# Altium project JadePlus_v0.3.1.PrjPcb
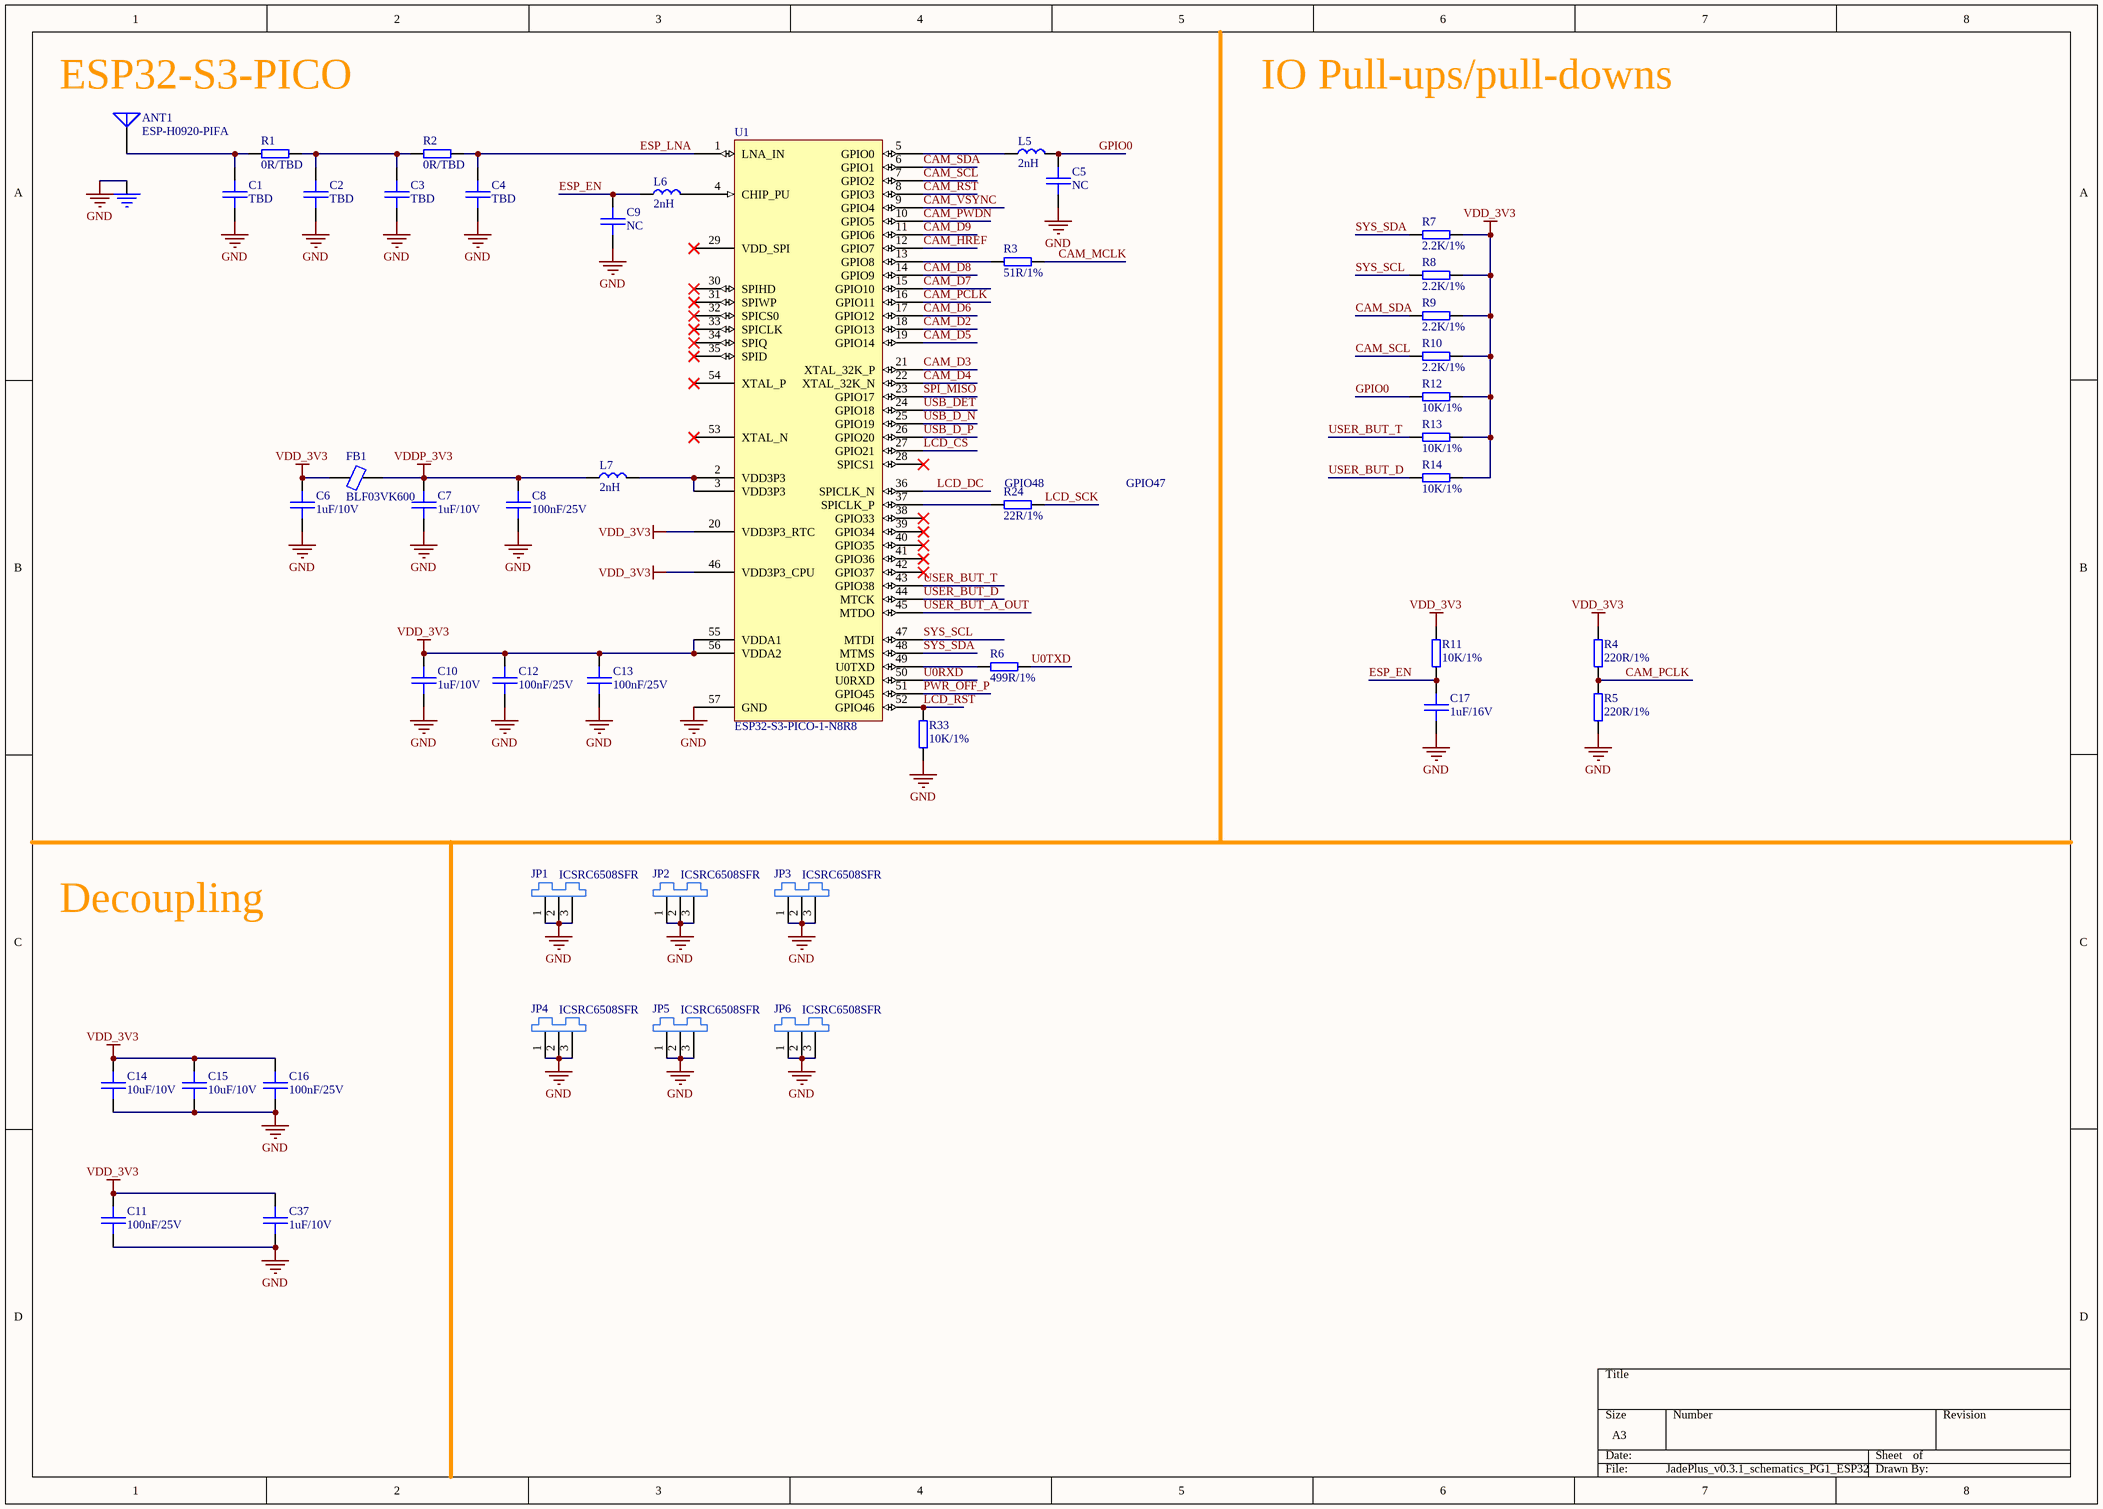
[diagram p0: JadePlus_v0.3.1_schematics_PG1_ESP32S3.SchDoc]
3 sheets, 120 parts. Net scope: global (net labels, ports and power ports of the same name join across sheets).
Board file: JadePlus_v0.3.1_board.PcbDoc
Sheets:
  JadePlus_v0.3.1_schematics_PG1_ESP32S3.SchDoc
  JadePlus_v0.3.1_schematics_PG2_PMS.SchDoc
  JadePlus_v0.3.1_schematics_PG3_CONN.SchDoc

## Sheet JadePlus_v0.3.1_schematics_PG1_ESP32S3.SchDoc
size A3; SheetNumber: 1; SheetTotal: 3

### Parts
ANT1  ESP-H0920-PIFA  [ESP-H0920-PIFA]
C1  TBD  [C0201-HD]
C2  TBD  [C0201-HD]
C3  TBD  [C0201-HD]
C4  TBD  [C0201-HD]
C5  NC  [C0201-HD]
C6  1uF/10V  [C0201-HD]
C7  1uF/10V  [C0201-HD]
C8  100nF/25V  [C0201-HD]
C9  NC  [C0201-HD]
C10  1uF/10V  [C0201-HD]
C11  100nF/25V  [C0201-HD]
C12  100nF/25V  [C0201-HD]
C13  100nF/25V  [C0201-HD]
C14  10uF/10V  [C0402-L-HD]
C15  10uF/10V  [C0402-L-HD]
C16  100nF/25V  [C0201-HD]
C17  1uF/16V  [C0402-HD]
C37  1uF/10V  [C0201-HD]
FB1  BLF03VK600  [L0201-HD]
JP1  ICSRC6508SFR  [SMD_3P-L6.7-W0.9-R3-P2.65-ICSRC6508SFR]
JP2  ICSRC6508SFR  [SMD_3P-L6.7-W0.9-R3-P2.65-ICSRC6508SFR]
JP3  ICSRC6508SFR  [SMD_3P-L6.7-W0.9-R3-P2.65-ICSRC6508SFR]
JP4  ICSRC6508SFR  [SMD_3P-L6.7-W0.9-R3-P2.65-ICSRC6508SFR]
JP5  ICSRC6508SFR  [SMD_3P-L6.7-W0.9-R3-P2.65-ICSRC6508SFR]
JP6  ICSRC6508SFR  [SMD_3P-L6.7-W0.9-R3-P2.65-ICSRC6508SFR]
L5  2nH  [L0201-HD]
L6  2nH  [L0201-HD]
L7  2nH  [L0201-HD]
R1  0R/TBD  [C0201-HD]
R2  0R/TBD  [C0201-HD]
R3  51R/1%  [R0402-HD]
R4  220R/1%  [R0402-HD]
R5  220R/1%  [R0402-HD]
R6  499R/1%  [R0402-HD]
R7  2.2K/1%  [R0402-HD]
R8  2.2K/1%  [R0402-HD]
R9  2.2K/1%  [R0402-HD]
R10  2.2K/1%  [R0402-HD]
R11  10K/1%  [R0402-HD]
R12  10K/1%  [R0402-HD]
R13  10K/1%  [R0402-HD]
R14  10K/1%  [R0402-HD]
R24  22R/1%  [R0402-HD]
R33  10K/1%  [R0402-HD]
U1  ESP32-S3-PICO-1-N8R8  [QFN40P700X700X90_HS-57N]

### Nets
GND: ANT1.2(G) C1.1 C2.1 C3.1 C4.1 C5.2 C6.2 C7.1 C8.2 C9.2 C10.2 C11.2 C12.2 C13.2 C14.1 C15.1 C16.2 C17.1 C37.2 JP1.1(GND) JP1.2(GND) JP1.3(GND) JP2.1(GND) JP2.2(GND) JP2.3(GND) JP3.1(GND) JP3.2(GND) JP3.3(GND) JP4.1(GND) JP4.2(GND) JP4.3(GND) JP5.1(GND) JP5.2(GND) JP5.3(GND) JP6.1(GND) JP6.2(GND) JP6.3(GND) R5.2 R33.1 U1.57(GND)
VDD_3V3: C6.1 C10.1 C11.1 C12.1 C13.1 C14.2 C15.2 C16.1 C37.1 FB1.2 R4.1 R7.2 R8.2 R9.2 R10.2 R11.1 R12.2 R13.2 R14.2 U1.20(VDD3P3_RTC) U1.46(VDD3P3_CPU) U1.55(VDDA1) U1.56(VDDA2)
VDDP_3V3: C7.2 C8.1 FB1.1 L7.2
CAM_D2: U1.18(GPIO13)
CAM_D3: U1.21(XTAL_32K_P)
CAM_D4: U1.22(XTAL_32K_N)
CAM_D5: U1.19(GPIO14)
CAM_D6: U1.17(GPIO12)
CAM_D7: U1.15(GPIO10)
CAM_D8: U1.14(GPIO9)
CAM_D9: U1.11(GPIO6)
CAM_HREF: U1.12(GPIO7)
CAM_MCLK: R3.1
CAM_PCLK: R4.2 R5.1 U1.16(GPIO11)
CAM_PWDN: U1.10(GPIO5)
CAM_RST: U1.8(GPIO3)
CAM_SCL: R10.1 U1.7(GPIO2)
CAM_SDA: R9.1 U1.6(GPIO1)
CAM_VSYNC: U1.9(GPIO4)
ESP_EN: C9.1 C17.2 L6.2 R11.2
ESP_LNA: C4.2 R2.2 U1.1(LNA_IN)
GPIO0: C5.1 L5.1 R12.1
LCD_CS: U1.27(GPIO21)
LCD_DC: U1.36(SPICLK_N)
LCD_RST: R33.2 U1.52(GPIO46)
LCD_SCK: R24.1
PWR_OFF_P: U1.51(GPIO45)
SPI_MISO: U1.23(GPIO17)
SYS_SCL: R8.1 U1.47(MTDI)
SYS_SDA: R7.1 U1.48(MTMS)
U0RXD: U1.50(U0RXD)
U0TXD: R6.1
USB_D_N: U1.25(GPIO19)
USB_D_P: U1.26(GPIO20)
USB_DET: U1.24(GPIO18)
USER_BUT_A_OUT: U1.45(MTDO)
USER_BUT_D: R14.1 U1.44(MTCK)
USER_BUT_T: R13.1 U1.43(GPIO38)
NetANT1_1: ANT1.1(A) C1.2 R1.1
NetC2_2: C2.2 C3.2 R1.2 R2.1
NetL5_2: L5.2 U1.5(GPIO0)
NetL6_1: L6.1 U1.4(CHIP_PU)
NetL7_1: L7.1 U1.2(VDD3P3) U1.3(VDD3P3)
NetR3_2: R3.2 U1.13(GPIO8)
NetR6_2: R6.2 U1.49(U0TXD)
NetR24_2: R24.2 U1.37(SPICLK_P)

Not connected (* = marked no-connect by the designer): U1 28(SPICS1)* 29(VDD_SPI)* 30(SPIHD)* 31(SPIWP)* 32(SPICS0)* 33(SPICLK)* 34(SPIQ)* 35(SPID)* 38(GPIO33)* 39(GPIO34)* 40(GPIO35)* 41(GPIO36)* 42(GPIO37)* 53(XTAL_N)* 54(XTAL_P)*

### Notes on the sheet
- (near ANT1) ESP32-S3-PICO
- IO Pull-ups/pull-downs
- (near R24) GPIO48
- GPIO47
- Decoupling

### Library data of the parts
ANT1 = Antenna_MIFA: Meandered Inverted F Antenna
C1-C17 C37 = SMT_C_0402: Surface mount capacitor 0402
FB1 = SMT_FB_0402: C1857815
L5-L7 = SMT_L_0201: Surface mount inductor 0201
R1-R14 R24 R33 = SMT_R_0402: Surface mount resistor 0402
U1 = ESP32-S3

## Sheet JadePlus_v0.3.1_schematics_PG2_PMS.SchDoc
size A3; SheetNumber: 2; SheetTotal: 3
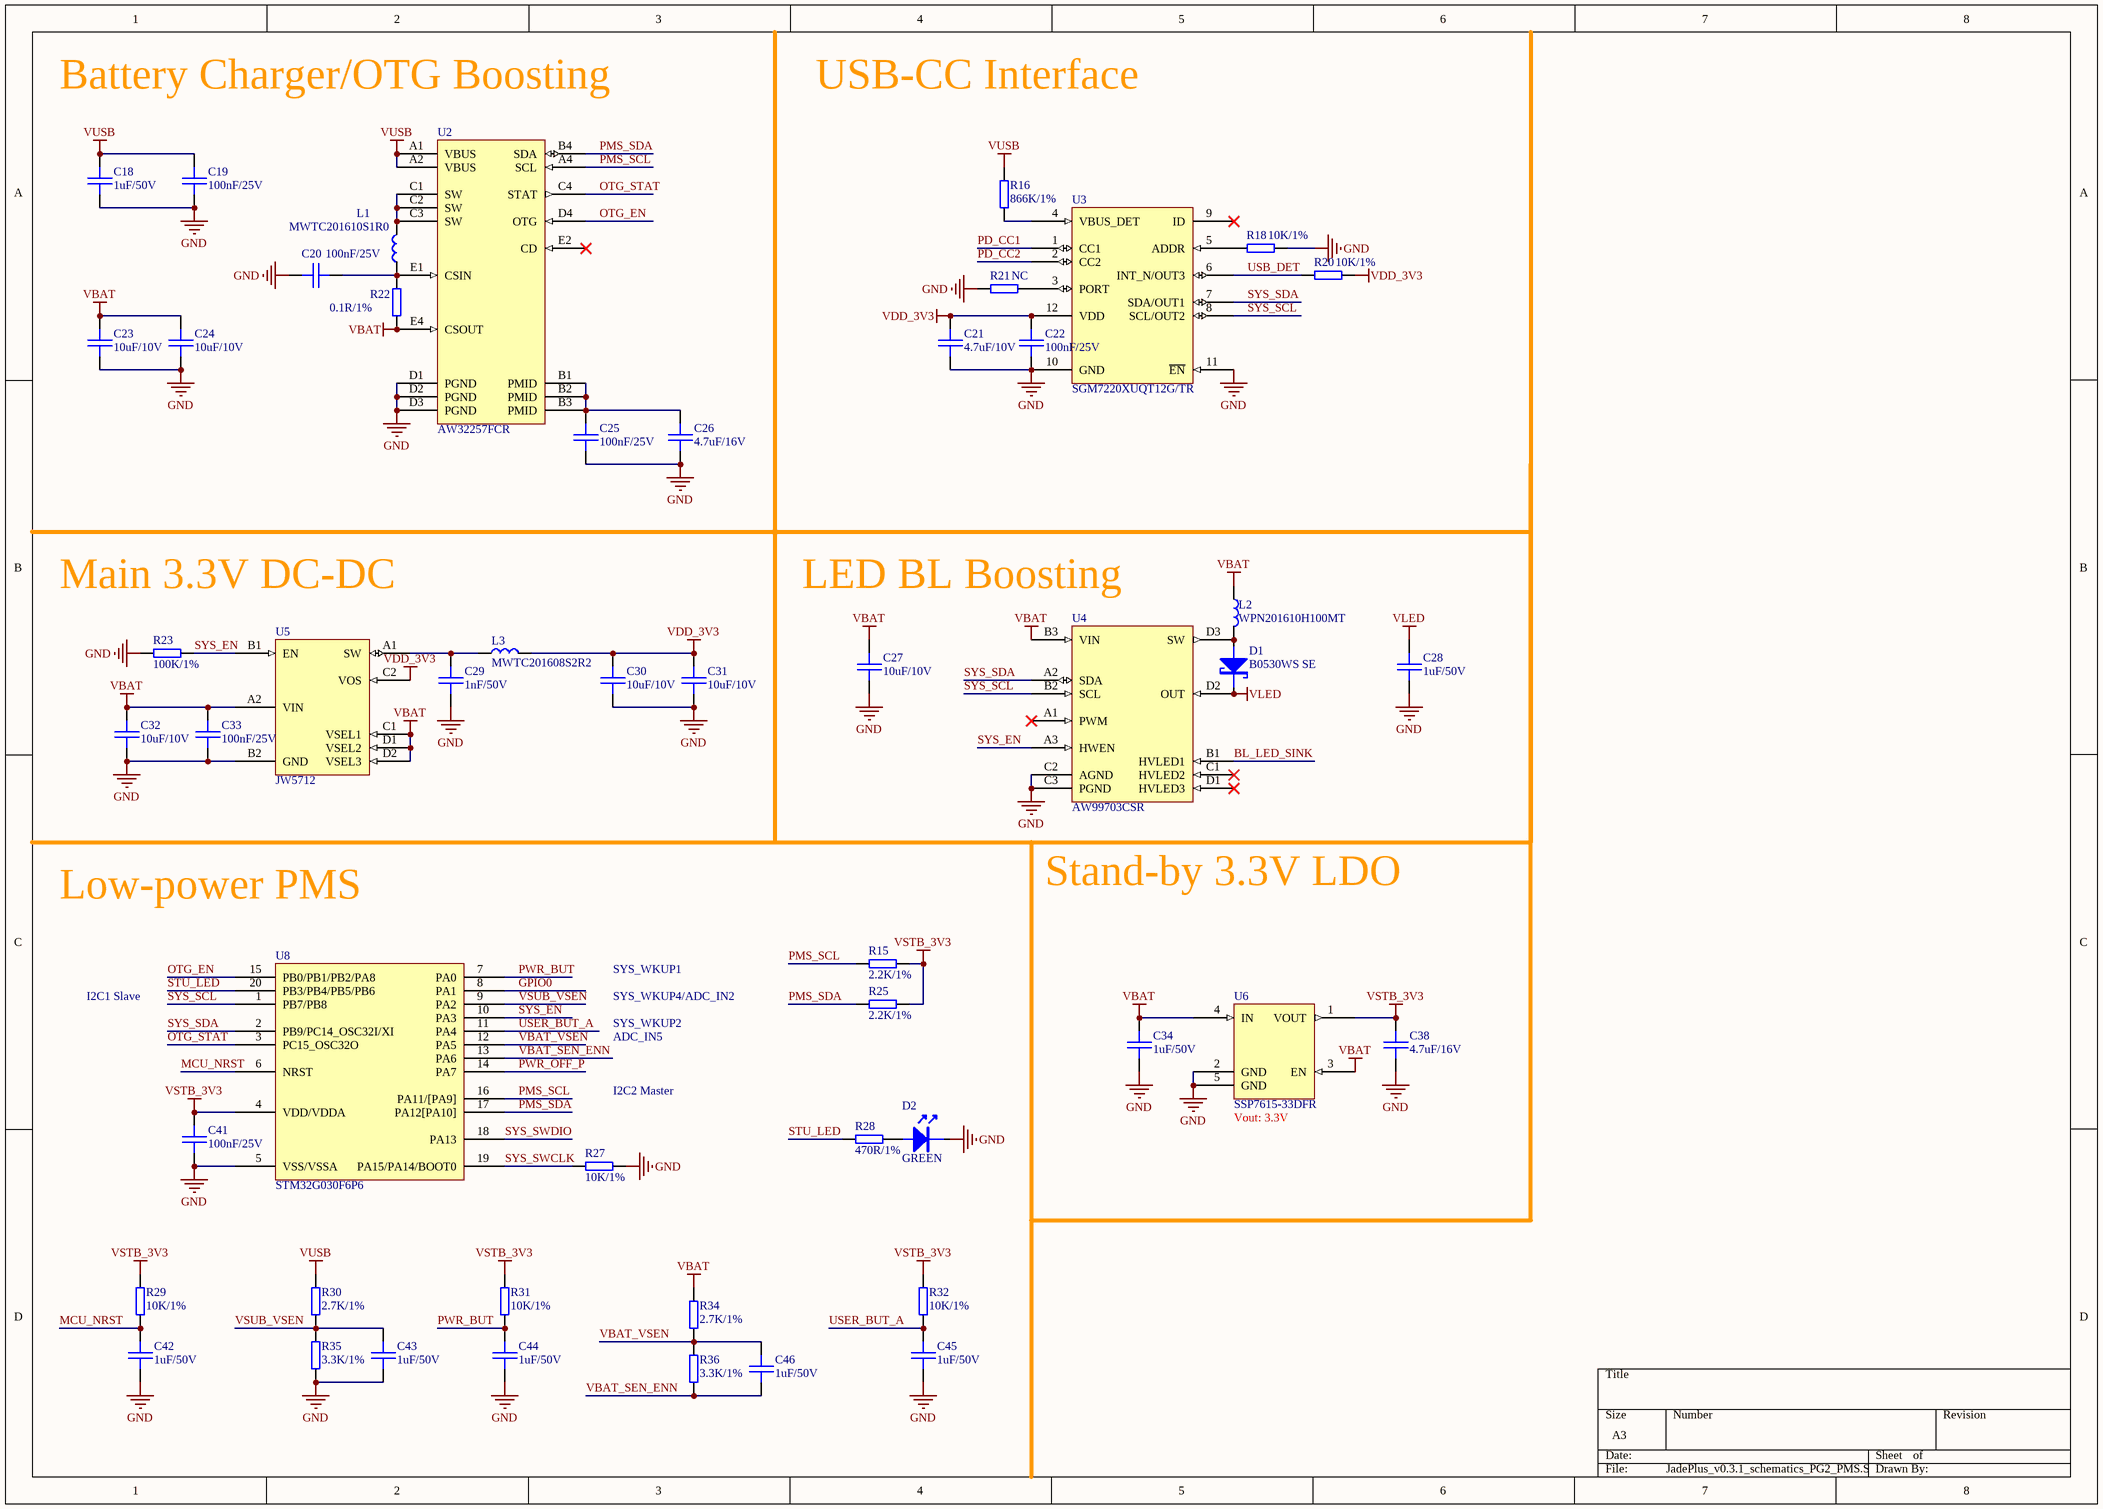
[diagram p1: JadePlus_v0.3.1_schematics_PG2_PMS.SchDoc]

### Parts
C18  1uF/50V  [C0402-L-HD]
C19  100nF/25V  [C0201-HD]
C20  100nF/25V  [C0402-HD]
C21  4.7uF/10V  [C0402-L-HD]
C22  100nF/25V  [C0201-HD]
C23  10uF/10V  [C0402-L-HD]
C24  10uF/10V  [C0402-L-HD]
C25  100nF/25V  [C0201-HD]
C26  4.7uF/16V  [C0402-L-HD]
C27  10uF/10V  [C0402-L-HD]
C28  1uF/50V  [C0402-L-HD]
C29  1nF/50V  [C0201-HD]
C30  10uF/10V  [C0402-L-HD]
C31  10uF/10V  [C0402-L-HD]
C32  10uF/10V  [C0402-L-HD]
C33  100nF/25V  [C0201-HD]
C34  1uF/50V  [C0402-L-HD]
C38  4.7uF/16V  [C0402-L-HD]
C41  100nF/25V  [C0201-HD]
C42  1uF/50V  [C0402-L-HD]
C43  1uF/50V  [C0402-L-HD]
C44  1uF/50V  [C0402-L-HD]
C45  1uF/50V  [C0402-L-HD]
C46  1uF/50V  [C0402-L-HD]
D1  B0530WS SE  [SMT_DIODE_SOD_323]
D2  GREEN  [SMT_LED_0603]
L1  MWTC201610S1R0  [MWTC201610-HD]
L2  WPN201610H100MT  [MWTC201610-HD]
L3  MWTC201608S2R2  [MWTC201610-HD]
R15  2.2K/1%  [R0402-HD]
R16  866K/1%  [R0402-HD]
R18  10K/1%  [R0402-HD]
R20  10K/1%  [R0402-HD]
R21  NC  [R0402-HD]
R22  0.1R/1%  [R0603-HD]
R23  100K/1%  [R0402-HD]
R25  2.2K/1%  [R0402-HD]
R27  10K/1%  [R0402-HD]
R28  470R/1%  [R0402-HD]
R29  10K/1%  [R0402-HD]
R30  2.7K/1%  [R0402-HD]
R31  10K/1%  [R0402-HD]
R32  10K/1%  [R0402-HD]
R34  2.7K/1%  [R0402-HD]
R35  3.3K/1%  [R0402-HD]
R36  3.3K/1%  [R0402-HD]
U2  AW32257FCR  [BGA20C40P4X5_200X200X60]
U3  SGM7220XUQT12G/TR  [QFN40P160X160X60-12L]
U4  AW99703CSR  [BGA12C40P3X4_124X164X64]
U5  JW5712  [BGA8C40P2X4_86X156X60]
U6  SSP7615-33DFR  [X2SON4]
U8  STM32G030F6P6  [TSOP-20-HD]

### Nets
GND: C18.1 C19.1 C20.2 C21.1 C22.1 C23.1 C24.1 C25.1 C26.1 C27.1 C28.1 C29.1 C30.1 C31.1 C32.1 C33.1 C34.1 C38.1 C41.1 C42.1 C43.1 C44.1 C45.1 D2.2(K) R18.2 R21.1 R23.1 R27.1 R35.2 U2.D1(PGND) U2.D2(PGND) U2.D3(PGND) U3.10(GND) U3.11(~{EN}) U4.C2(AGND) U4.C3(PGND) U5.B2(GND) U6.2(GND) U6.5(GND) U8.5(VSS/VSSA)
VBAT: C23.2 C24.2 C27.2 C32.2 C33.2 C34.2 L2.1 R22.1 R34.1 U2.E4(CSOUT) U4.B3(VIN) U5.A2(VIN) U5.C1(VSEL1) U5.D1(VSEL2) U5.D2(VSEL3) U6.3(EN) U6.4(IN)
VDD_3V3: C21.2 C22.2 C30.2 C31.2 L3.1 R20.2 U3.12(VDD) U5.C2(VOS)
VLED: C28.2 D1.2(K) U4.D2(OUT)
VSTB_3V3: C38.2 C41.2 R15.2 R25.2 R29.1 R31.1 R32.1 U6.1(VOUT) U8.4(VDD/VDDA)
VUSB: C18.2 C19.2 R16.1 R30.1 U2.A1(VBUS) U2.A2(VBUS)
BL_LED_SINK: U4.B1(HVLED1)
GPIO0: U8.8(PA1)
MCU_NRST: C42.2 R29.2 U8.6(NRST)
OTG_EN: U2.D4(OTG) U8.15(PB0/PB1/PB2/PA8)
OTG_STAT: U2.C4(STAT) U8.3(PC15_OSC32O)
PD_CC1: U3.1(CC1)
PD_CC2: U3.2(CC2)
PMS_SCL: R15.1 U2.A4(SCL) U8.16(PA11/[PA9])
PMS_SDA: R25.1 U2.B4(SDA) U8.17(PA12[PA10])
PWR_BUT: C44.2 R31.2 U8.7(PA0)
PWR_OFF_P: U8.14(PA7)
STU_LED: R28.2 U8.20(PB3/PB4/PB5/PB6)
SYS_EN: R23.2 U4.A3(HWEN) U5.B1(EN) U8.10(PA3)
SYS_SCL: U3.8(SCL/OUT2) U4.B2(SCL) U8.1(PB7/PB8)
SYS_SDA: U3.7(SDA/OUT1) U4.A2(SDA) U8.2(PB9/PC14_OSC32I/XI)
SYS_SWCLK: R27.2 U8.19(PA15/PA14/BOOT0)
SYS_SWDIO: U8.18(PA13)
USB_DET: R20.1 U3.6(INT_N/OUT3)
USER_BUT_A: C45.2 R32.2 U8.11(PA4)
VBAT_SEN_ENN: C46.1 R36.2 U8.13(PA6)
VBAT_VSEN: C46.2 R34.2 R36.1 U8.12(PA5)
VSUB_VSEN: C43.2 R30.2 R35.1 U8.9(PA2)
NetC20_1: C20.1 L1.2 R22.2 U2.E1(CSIN)
NetC25_2: C25.2 C26.2 U2.B1(PMID) U2.B2(PMID) U2.B3(PMID)
NetC29_2: C29.2 L3.2 U5.A1(SW)
NetD1_1: D1.1(A) L2.2 U4.D3(SW)
NetD2_1: D2.1(A) R28.1
NetL1_1: L1.1 U2.C1(SW) U2.C2(SW) U2.C3(SW)
NetR16_2: R16.2 U3.4(VBUS_DET)
NetR18_1: R18.1 U3.5(ADDR)
NetR21_2: R21.2 U3.3(PORT)

Not connected (* = marked no-connect by the designer): U2 E2(CD)*; U3 9(ID)*; U4 A1(PWM)* C1(HVLED2)* D1(HVLED3)*

### Notes on the sheet
- Battery Charger/OTG Boosting
- USB-CC Interface
- Main 3.3V DC-DC
- LED BL Boosting
- Low-power PMS
- Stand-by 3.3V LDO
- SYS_WKUP1
- I2C1 Slave
- SYS_WKUP4/ADC_IN2
- SYS_WKUP2
- ADC_IN5
- I2C2 Master
- (near U6) Vout: 3.3V

### Library data of the parts
C18-C34 C38 C41-C46 = SMT_C_0402: Surface mount capacitor 0402
D1 = SMT_DIODE_SCHOTTKY_SOD_323: Surface mount schottky diode SOD-323(0805) Package / C22626
D2 = SMT_LED_0603: Surface mount LED 0603
L1-L3 = SMT_L_0805: Surface mount inductor 0805
R15 R16 R18 R20 R21 R23 R25 R27-R32 R34-R36 = SMT_R_0402: Surface mount resistor 0402
R22 = SMT_R_0603: Surface mount resistor 0603
U2 = AW32257
U3 = SGM7220: SGM7220XUQT12G/TR / TUSB320 / HUSB320_BA000-QN12R
U4 = AW99703
U6 = AP7343: 300mA HIGH PSRR LOW NOISE LDO WITH ENABLE

## Sheet JadePlus_v0.3.1_schematics_PG3_CONN.SchDoc
size A3; SheetNumber: 3; SheetTotal: 3
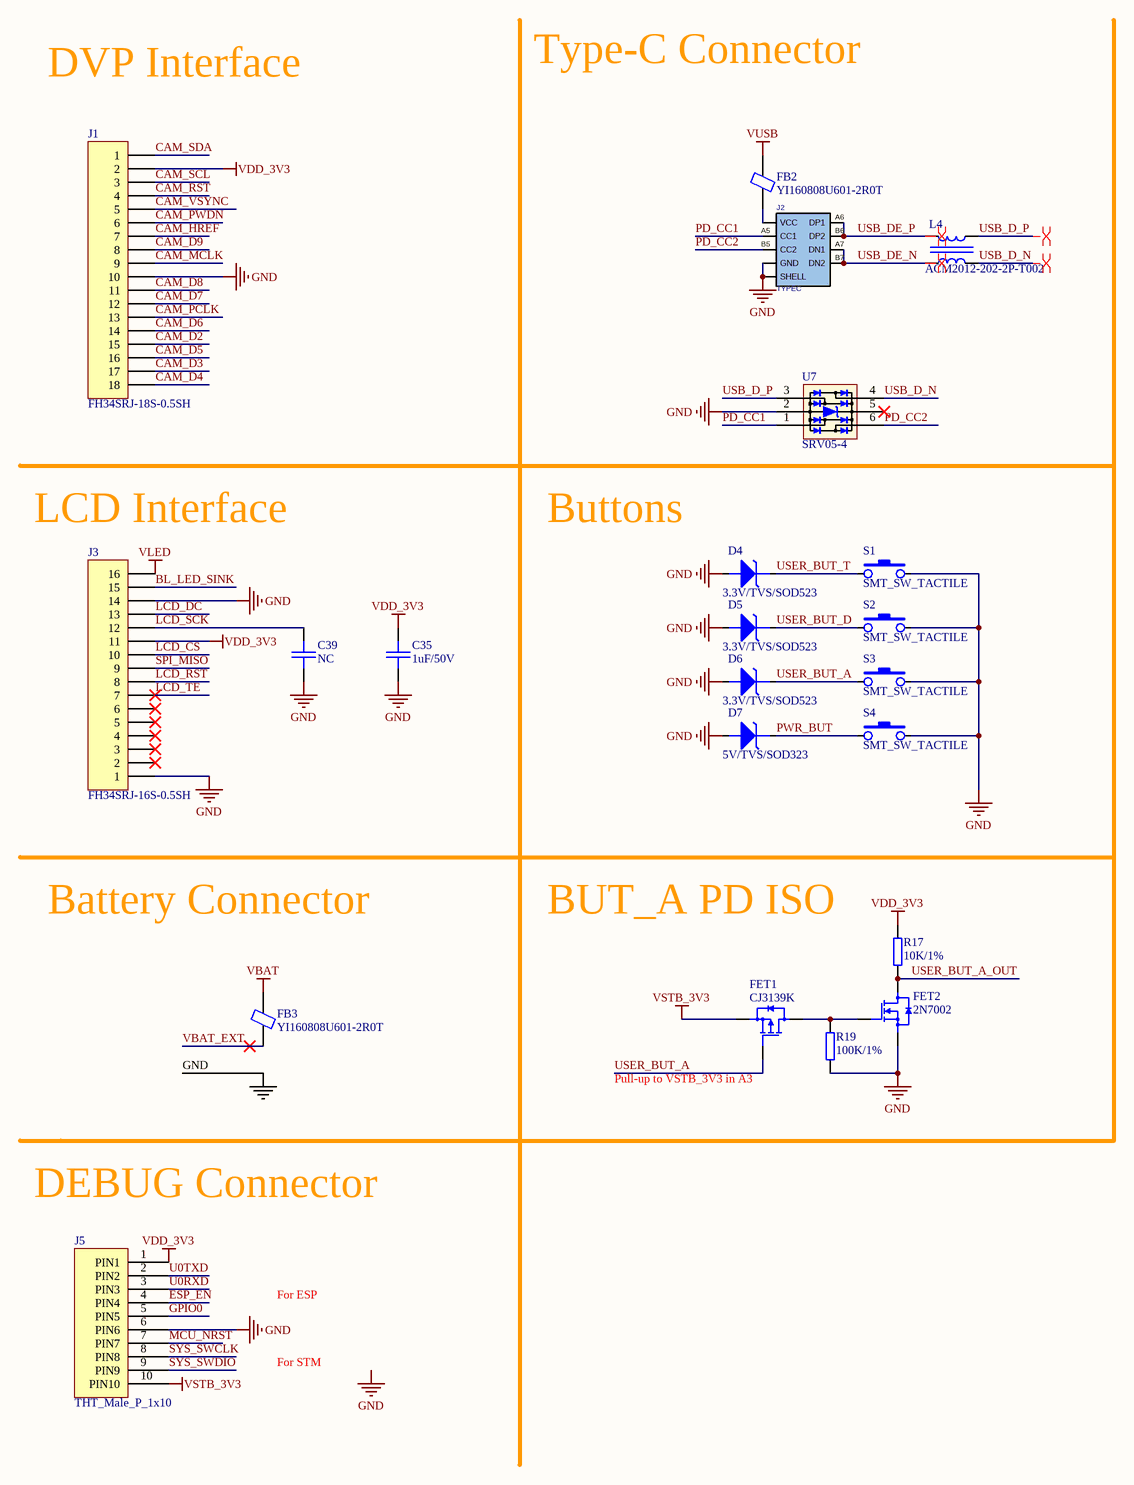
[diagram p2: JadePlus_v0.3.1_schematics_PG3_CONN.SchDoc]

### Parts
C35  1uF/50V  [C0402-L-HD]
C39  NC  [C0201-HD]
D4  3.3V/TVS/SOD523  [SMT_DIODE_SOD_523]
D5  3.3V/TVS/SOD523  [SMT_DIODE_SOD_523]
D6  3.3V/TVS/SOD523  [SMT_DIODE_SOD_523]
D7  5V/TVS/SOD323  [SMT_DIODE_SOD_323]
FB2  YI160808U601-2R0T  [L0603-HD]
FB3  YI160808U601-2R0T  [L0603-HD]
FET1  CJ3139K  [SOT-723-HD]
FET2  2N7002  [SOT-723-HD]
J1  FH34SRJ-18S-0.5SH  [FH34SRJ-18S-0.5SH]
J2  TYPEC  [USB_TYPEC_16P_HD]
J3  FH34SRJ-16S-0.5SH  [FPC_0.5MM_16P_H1.0_DNUP_FH34SRJ-16S-0.5SH]
J5  THT_Male_P_1x10  [THT_Male_P_1x10-2.54mm]
L4  ACM2012-202-2P-T002  [ACM2012]
R17  10K/1%  [R0402-HD]
R19  100K/1%  [R0402-HD]
S1  SMT_SW_TACTILE  [SMT_SW_TS_1186D_C_A]
S2  SMT_SW_TACTILE  [SMT_SW_TS_1186D_C_A]
S3  SMT_SW_TACTILE  [SMT_SW_PTS_820]
S4  SMT_SW_TACTILE  [SMT_SW_TS_1186D_C_A]
U7  SRV05-4  [SOT-236-HD]

### Nets
GND: C35.1 C39.2 D4.1(A) D5.1(A) D6.1(A) D7.1(A) FET2.2(S) J1.10 J2.GND J2.SHELL J3.1 J3.14 J5.6(PIN6) R19.2 S1.2 S2.2 S3.2 S4.2 U7.2
VBAT: FB3.1
VDD_3V3: C35.2 J1.2 J3.11 J5.1(PIN1) R17.1
VLED: J3.16
VSTB_3V3: FET1.2(S) J5.10(PIN10)
VUSB: FB2.1
BL_LED_SINK: J3.15
CAM_D2: J1.15
CAM_D3: J1.17
CAM_D4: J1.18
CAM_D5: J1.16
CAM_D6: J1.14
CAM_D7: J1.12
CAM_D8: J1.11
CAM_D9: J1.8
CAM_HREF: J1.7
CAM_MCLK: J1.9
CAM_PCLK: J1.13
CAM_PWDN: J1.6
CAM_RST: J1.4
CAM_SCL: J1.3
CAM_SDA: J1.1
CAM_VSYNC: J1.5
ESP_EN: J5.4(PIN4)
GPIO0: J5.5(PIN5)
LCD_CS: J3.10
LCD_DC: J3.13
LCD_RST: J3.8
LCD_SCK: C39.1 J3.12
LCD_TE: J3.7
MCU_NRST: J5.7(PIN7)
PD_CC1: J2.A5(CC1) U7.1
PD_CC2: J2.B5(CC2) U7.6
PWR_BUT: D7.2(K) S4.1
SPI_MISO: J3.9
SYS_SWCLK: J5.8(PIN8)
SYS_SWDIO: J5.9(PIN9)
U0RXD: J5.3(PIN3)
U0TXD: J5.2(PIN2)
USB_D_N: L4.3 U7.4
USB_D_P: L4.4 U7.3
USB_DE_N: J2.A7(DN1) J2.B7(DN2) L4.2
USB_DE_P: J2.A6(DP1) J2.B6(DP2) L4.1
USER_BUT_A: D6.2(K) FET1.1(G) S3.1
USER_BUT_A_OUT: FET2.3(D) R17.2
USER_BUT_D: D5.2(K) S2.1
USER_BUT_T: D4.2(K) S1.1
VBAT_EXT: FB3.2
NetFB2_2: FB2.2 J2.VBUS(VCC)
NetFET1_3: FET1.3(D) FET2.1(G) R19.1

Not connected (* = marked no-connect by the designer): J3 2* 3* 4* 5* 6*; U7 5*

### Layout directives
differential pair: USB_D_N, USB_D_P, USB_DE_N, USB_DE_P

### Notes on the sheet
- DVP Interface
- Type-C Connector
- (near J3) LCD Interface
- Buttons
- Battery Connector
- BUT_A PD ISO
- GND
- (near FET1) Pull-up to VSTB_3V3 in A3
- DEBUG Connector
- For ESP
- For STM
- Labels drawn without touching a wire or pin: GND

### Library data of the parts
C35 C39 = SMT_C_0402: Surface mount capacitor 0402
D4-D7 = SMT_DIODE_TVS_U_SOD_523: Surface mount unidirectional TVS diode SOD-523(0603) Package
FB2 FB3 = SMT_FB_0603: Surface mount ferrite beads 0603
FET1 = SI2301-P-Ch-MOSFET: SI2301-P-Ch,-2.3A, -20V.RDS(ON) = 0.190Ω @ VGS = -2.5 V
FET2 = SI2302-N-Ch-MOSFET: SI2302-N-Ch,3A, 20V.RDS(ON) = 0.082Ω @ VGS = 2.5 V
J1 = Header 18: Header, 18-Pin; LatestRevisionDate: 17-Jul-2002; LatestRevisionNote: Re-released for DXP Platform.; Publisher: Altium Limited
J2 = USB_TYPEC_16P
J3 = Header 16: Header, 16-Pin; LatestRevisionDate: 17-Jul-2002; LatestRevisionNote: Re-released for DXP Platform.; Publisher: Altium Limited
J5 = THT_Male_P_1x10: THT Male pin header strip 1x10
L4 = ACM2012
R17 R19 = SMT_R_0402: Surface mount resistor 0402
S1-S4 = SMT_SW_TACTILE: Generic SMT Tactile Switch
U7 = SRV05-4: Low Capacitance(3pF) TVS Diode Array

## Nets that join several sheets
GND: JadePlus_v0.3.1_schematics_PG1_ESP32S3 (40 pins), JadePlus_v0.3.1_schematics_PG2_PMS (40 pins), JadePlus_v0.3.1_schematics_PG3_CONN (19 pins)
VBAT: JadePlus_v0.3.1_schematics_PG2_PMS (17 pins), JadePlus_v0.3.1_schematics_PG3_CONN (FB3.1)
VDD_3V3: JadePlus_v0.3.1_schematics_PG1_ESP32S3 (23 pins), JadePlus_v0.3.1_schematics_PG2_PMS (8 pins), JadePlus_v0.3.1_schematics_PG3_CONN (5 pins)
VLED: JadePlus_v0.3.1_schematics_PG2_PMS (C28.2 D1.2 U4.D2), JadePlus_v0.3.1_schematics_PG3_CONN (J3.16)
VSTB_3V3: JadePlus_v0.3.1_schematics_PG2_PMS (9 pins), JadePlus_v0.3.1_schematics_PG3_CONN (FET1.2 J5.10)
VUSB: JadePlus_v0.3.1_schematics_PG2_PMS (6 pins), JadePlus_v0.3.1_schematics_PG3_CONN (FB2.1)
BL_LED_SINK: JadePlus_v0.3.1_schematics_PG2_PMS (U4.B1), JadePlus_v0.3.1_schematics_PG3_CONN (J3.15)
CAM_D2: JadePlus_v0.3.1_schematics_PG1_ESP32S3 (U1.18), JadePlus_v0.3.1_schematics_PG3_CONN (J1.15)
CAM_D3: JadePlus_v0.3.1_schematics_PG1_ESP32S3 (U1.21), JadePlus_v0.3.1_schematics_PG3_CONN (J1.17)
CAM_D4: JadePlus_v0.3.1_schematics_PG1_ESP32S3 (U1.22), JadePlus_v0.3.1_schematics_PG3_CONN (J1.18)
CAM_D5: JadePlus_v0.3.1_schematics_PG1_ESP32S3 (U1.19), JadePlus_v0.3.1_schematics_PG3_CONN (J1.16)
CAM_D6: JadePlus_v0.3.1_schematics_PG1_ESP32S3 (U1.17), JadePlus_v0.3.1_schematics_PG3_CONN (J1.14)
CAM_D7: JadePlus_v0.3.1_schematics_PG1_ESP32S3 (U1.15), JadePlus_v0.3.1_schematics_PG3_CONN (J1.12)
CAM_D8: JadePlus_v0.3.1_schematics_PG1_ESP32S3 (U1.14), JadePlus_v0.3.1_schematics_PG3_CONN (J1.11)
CAM_D9: JadePlus_v0.3.1_schematics_PG1_ESP32S3 (U1.11), JadePlus_v0.3.1_schematics_PG3_CONN (J1.8)
CAM_HREF: JadePlus_v0.3.1_schematics_PG1_ESP32S3 (U1.12), JadePlus_v0.3.1_schematics_PG3_CONN (J1.7)
CAM_MCLK: JadePlus_v0.3.1_schematics_PG1_ESP32S3 (R3.1), JadePlus_v0.3.1_schematics_PG3_CONN (J1.9)
CAM_PCLK: JadePlus_v0.3.1_schematics_PG1_ESP32S3 (R4.2 R5.1 U1.16), JadePlus_v0.3.1_schematics_PG3_CONN (J1.13)
CAM_PWDN: JadePlus_v0.3.1_schematics_PG1_ESP32S3 (U1.10), JadePlus_v0.3.1_schematics_PG3_CONN (J1.6)
CAM_RST: JadePlus_v0.3.1_schematics_PG1_ESP32S3 (U1.8), JadePlus_v0.3.1_schematics_PG3_CONN (J1.4)
CAM_SCL: JadePlus_v0.3.1_schematics_PG1_ESP32S3 (R10.1 U1.7), JadePlus_v0.3.1_schematics_PG3_CONN (J1.3)
CAM_SDA: JadePlus_v0.3.1_schematics_PG1_ESP32S3 (R9.1 U1.6), JadePlus_v0.3.1_schematics_PG3_CONN (J1.1)
CAM_VSYNC: JadePlus_v0.3.1_schematics_PG1_ESP32S3 (U1.9), JadePlus_v0.3.1_schematics_PG3_CONN (J1.5)
ESP_EN: JadePlus_v0.3.1_schematics_PG1_ESP32S3 (C9.1 C17.2 L6.2 R11.2), JadePlus_v0.3.1_schematics_PG3_CONN (J5.4)
GPIO0: JadePlus_v0.3.1_schematics_PG1_ESP32S3 (C5.1 L5.1 R12.1), JadePlus_v0.3.1_schematics_PG2_PMS (U8.8), JadePlus_v0.3.1_schematics_PG3_CONN (J5.5)
LCD_CS: JadePlus_v0.3.1_schematics_PG1_ESP32S3 (U1.27), JadePlus_v0.3.1_schematics_PG3_CONN (J3.10)
LCD_DC: JadePlus_v0.3.1_schematics_PG1_ESP32S3 (U1.36), JadePlus_v0.3.1_schematics_PG3_CONN (J3.13)
LCD_RST: JadePlus_v0.3.1_schematics_PG1_ESP32S3 (R33.2 U1.52), JadePlus_v0.3.1_schematics_PG3_CONN (J3.8)
LCD_SCK: JadePlus_v0.3.1_schematics_PG1_ESP32S3 (R24.1), JadePlus_v0.3.1_schematics_PG3_CONN (C39.1 J3.12)
MCU_NRST: JadePlus_v0.3.1_schematics_PG2_PMS (C42.2 R29.2 U8.6), JadePlus_v0.3.1_schematics_PG3_CONN (J5.7)
PD_CC1: JadePlus_v0.3.1_schematics_PG2_PMS (U3.1), JadePlus_v0.3.1_schematics_PG3_CONN (J2.A5 U7.1)
PD_CC2: JadePlus_v0.3.1_schematics_PG2_PMS (U3.2), JadePlus_v0.3.1_schematics_PG3_CONN (J2.B5 U7.6)
PWR_BUT: JadePlus_v0.3.1_schematics_PG2_PMS (C44.2 R31.2 U8.7), JadePlus_v0.3.1_schematics_PG3_CONN (D7.2 S4.1)
PWR_OFF_P: JadePlus_v0.3.1_schematics_PG1_ESP32S3 (U1.51), JadePlus_v0.3.1_schematics_PG2_PMS (U8.14)
SPI_MISO: JadePlus_v0.3.1_schematics_PG1_ESP32S3 (U1.23), JadePlus_v0.3.1_schematics_PG3_CONN (J3.9)
SYS_SCL: JadePlus_v0.3.1_schematics_PG1_ESP32S3 (R8.1 U1.47), JadePlus_v0.3.1_schematics_PG2_PMS (U3.8 U4.B2 U8.1)
SYS_SDA: JadePlus_v0.3.1_schematics_PG1_ESP32S3 (R7.1 U1.48), JadePlus_v0.3.1_schematics_PG2_PMS (U3.7 U4.A2 U8.2)
SYS_SWCLK: JadePlus_v0.3.1_schematics_PG2_PMS (R27.2 U8.19), JadePlus_v0.3.1_schematics_PG3_CONN (J5.8)
SYS_SWDIO: JadePlus_v0.3.1_schematics_PG2_PMS (U8.18), JadePlus_v0.3.1_schematics_PG3_CONN (J5.9)
U0RXD: JadePlus_v0.3.1_schematics_PG1_ESP32S3 (U1.50), JadePlus_v0.3.1_schematics_PG3_CONN (J5.3)
U0TXD: JadePlus_v0.3.1_schematics_PG1_ESP32S3 (R6.1), JadePlus_v0.3.1_schematics_PG3_CONN (J5.2)
USB_D_N: JadePlus_v0.3.1_schematics_PG1_ESP32S3 (U1.25), JadePlus_v0.3.1_schematics_PG3_CONN (L4.3 U7.4)
USB_D_P: JadePlus_v0.3.1_schematics_PG1_ESP32S3 (U1.26), JadePlus_v0.3.1_schematics_PG3_CONN (L4.4 U7.3)
USB_DET: JadePlus_v0.3.1_schematics_PG1_ESP32S3 (U1.24), JadePlus_v0.3.1_schematics_PG2_PMS (R20.1 U3.6)
USER_BUT_A: JadePlus_v0.3.1_schematics_PG2_PMS (C45.2 R32.2 U8.11), JadePlus_v0.3.1_schematics_PG3_CONN (D6.2 FET1.1 S3.1)
USER_BUT_A_OUT: JadePlus_v0.3.1_schematics_PG1_ESP32S3 (U1.45), JadePlus_v0.3.1_schematics_PG3_CONN (FET2.3 R17.2)
USER_BUT_D: JadePlus_v0.3.1_schematics_PG1_ESP32S3 (R14.1 U1.44), JadePlus_v0.3.1_schematics_PG3_CONN (D5.2 S2.1)
USER_BUT_T: JadePlus_v0.3.1_schematics_PG1_ESP32S3 (R13.1 U1.43), JadePlus_v0.3.1_schematics_PG3_CONN (D4.2 S1.1)